# EasyEDA Pro project examples.epro, schematic Schematic2
Create Date: 2026-03-05; Page Name: P1; Project Name: EdaCopilotExamples; Schematic Name: Schematic2; Update Date: 2026-03-05; Company: EasyEDA.com; Page Size: A4; Version: V1.0
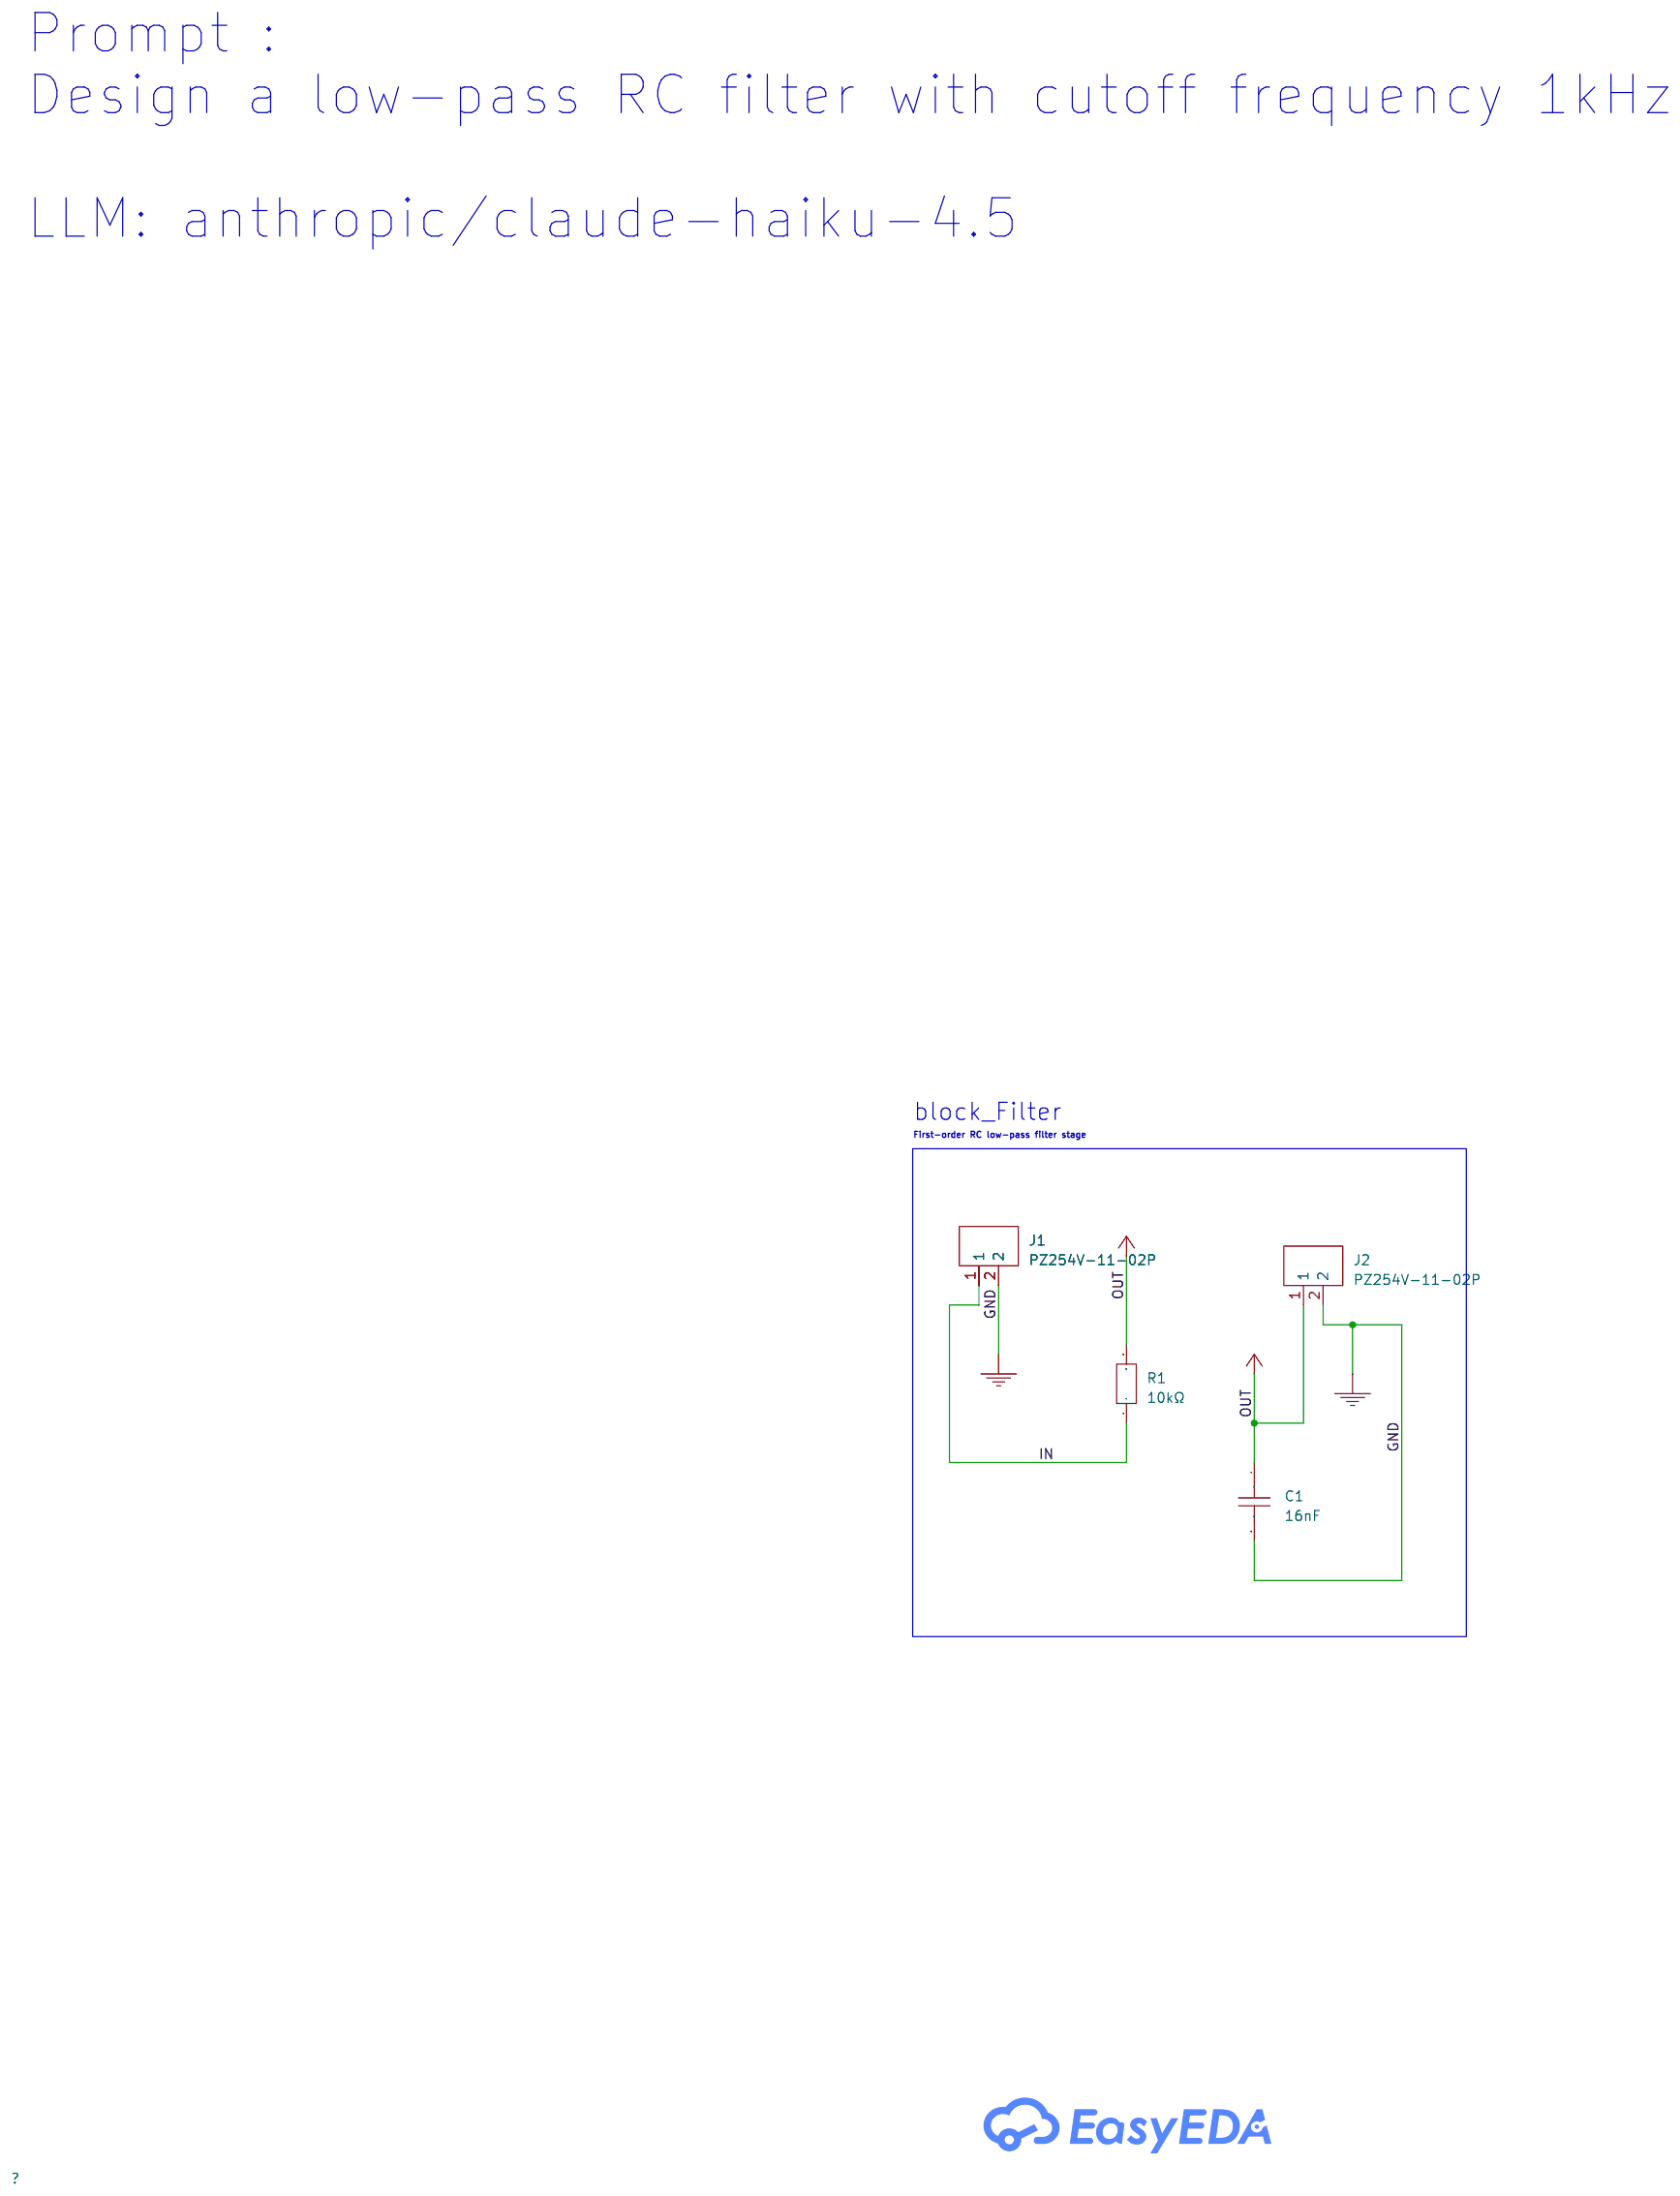
[diagram p1: schematic sheet]

## Parts
C1  16nF  [CAP-TH_L9.5-W5.0-P5.00-D1.2]
J1  PZ254V-11-02P  [HDR-TH_2P-P2.54-V-M]
J2  PZ254V-11-02P  [HDR-TH_2P-P2.54-V-M]
R1  10kΩ  [R0603]

## Library data of the parts
C1 = MPP163G2J3ES2027A1: Capacitance:16nF Tolerance:±2% Tolerance:±2% Voltage Rating:630V Operating Temperature:-40℃~+105℃ Operating Temperature:-40℃~+105℃; LCSC Part Name: 16nF ±2% 630V; Supplier Part: C18185874; Manufacturer: JOEY(久亦); Supplier Footprint: 插件,P=5mm; JLCPCB Part Class: Extended Part; Datasheet: https://item.szlcsc.com/datasheet/MPP163G2J3ES2027A1/19332872.html; Supplier: LCSC; Tolerance: ±2%; Voltage Rating: 630V; Operating Temperature: -40℃~+105℃; supplier: LCSC; supplierId: C18185874
J1 J2 = PZ254V-11-02P: Pin Structure:1x2P Pitch:2.54mm Row Spacing:- Circluar Pins/Square Pins:Pin Header Mounting Type:Through Hole Number of Rows:1 Number of Pins:2P Current Rating:- Voltage Rating (Max):- Length of Mating Pin:6mm Insulation Height:2.5mm Length of End Connect; LCSC Part Name: 1x2P 间距:2.54mm 方针 直插; Supplier Part: C492401; Manufacturer: XFCN(兴飞); Supplier Footprint: 插件,P=2.54mm; JLCPCB Part Class: Extended Part; Datasheet: https://item.szlcsc.com/datasheet/PZ254V-11-02P/502957.html; Supplier: LCSC; Pin Structure: 1x2P; Pitch: 2.54mm; Circluar Pins/Square Pins: Pin Header; Mounting Type: Through Hole; Number of Rows: 1; Number of Pins: 2P; Length of Mating Pin: 6mm; Insulation Height: 2.5mm; Length of End Connection Pin: 3mm; Contact Material: Brass; Operating Temperature: -40℃~+105℃; Color: Black; supplier: LCSC; supplierId: C492401
R1 = FRC0603J103 TS: Type:Thick Film Resistor Resistance:10kΩ Tolerance:±5% Tolerance:±5% Power(Watts):100mW Voltage-Supply(Max):75V Temperature Coefficient:±100ppm/℃ Temperature Coefficient:±100ppm/℃ Operating Temperature:-55℃~+155℃ Operating Temperature:-55℃~+155℃; LCSC Part Name: 10kΩ ±5% 100mW 厚膜电阻; Supplier Part: C2930027; Manufacturer: FOJAN(富捷); Supplier Footprint: 0603; JLCPCB Part Class: Extended Part; Datasheet: https://item.szlcsc.com/datasheet/FRC0603J103%2520TS/3266960.html; Supplier: LCSC; Type: Thick Film Resistor; Tolerance: ±5%; Power(Watts): 100mW; Voltage-Supply(Max): 75V; Temperature Coefficient: ±100ppm/℃; Operating Temperature: -55℃~+155℃; supplier: LCSC; supplierId: C2930027

## Nets
GND: C1.2 J1.2 J2.2
IN: J1.1 R1.1
OUT: C1.1 J2.1 R1.2

## Notes on the sheet
- Prompt :
  Design a low-pass RC filter with cutoff frequency 1kHz
  LLM: anthropic/claude-haiku-4.5
- block_Filter
- First-order RC low-pass filter stage
